# Altium project PCB_Project.PrjPcb
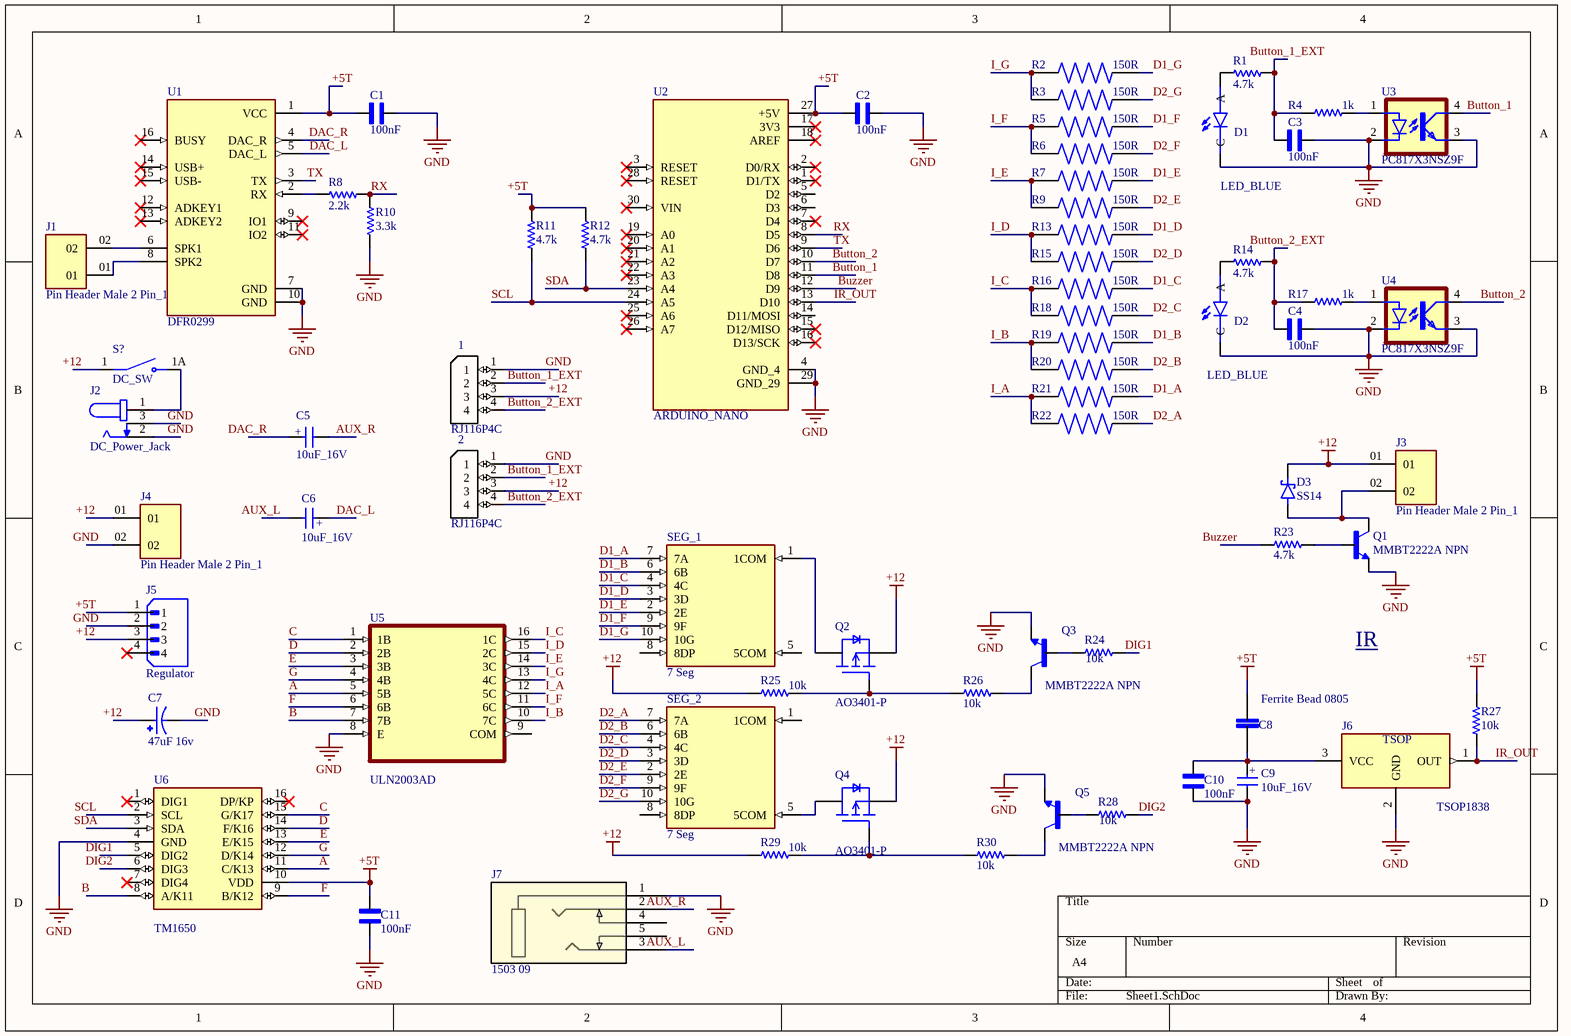
[diagram p0: Sheet1.SchDoc]
1 sheet, 67 parts. Net scope: global (net labels, ports and power ports of the same name join across sheets).
Board file: PCB1.PcbDoc

## Sheet Sheet1.SchDoc
size A4; SheetNumber: 1; SheetTotal: 1

### Parts
1  RJ116P4C  [*RJ6P4C]
2  RJ116P4C  [*RJ6P4C]
C1  100nF  [Capacitor 0805]
C2  100nF  [Capacitor 0805]
C3  100nF  [Capacitor 0805]
C4  100nF  [Capacitor 0805]
C5  10uF_16V  [10uF_16V]
C6  10uF_16V  [10uF_16V]
C7  47uF 16v  [47uf 16v]
C8  Ferrite Bead 0805  [Ferrite Bead 0805]
C9  10uF_16V  [10uF_16V]
C10  100nF  [Capacitor 0805]
C11  100nF  [Capacitor 0805]
D1  LED_BLUE  [LED_0603]
D2  LED_BLUE  [LED_0603]
D3  SS14  [SS14]
J1  Pin Header Male 2 Pin_1  [2Pin-M-Header_3MX1-254MM - duplicate]
J2  DC_Power_Jack  [DC_Power_Jack]
J3  Pin Header Male 2 Pin_1  [2Pin-M-Header_3MX1-254MM - duplicate]
J4  Pin Header Male 2 Pin_1  [2Pin-M-Header_3MX1-254MM - duplicate]
J5  Regulator  [Regulator]
J6  TSOP1838  [TSOP1838]
J7  1503 09  [3.5mm_AUX]
Q1  MMBT2222A NPN  [NPN_SOT23]
Q2  AO3401-P  [AO-3401-P-SOT23-3]
Q3  MMBT2222A NPN  [NPN_SOT23]
Q4  AO3401-P  [AO-3401-P-SOT23-3]
Q5  MMBT2222A NPN  [NPN_SOT23]
R1  4.7k  [RES0603]
R2  150R  [RESC3115X65N]
R3  150R  [RESC3115X65N]
R4  1k  [RES0603]
R5  150R  [RESC3115X65N]
R6  150R  [RESC3115X65N]
R7  150R  [RESC3115X65N]
R8  2.2k  [RES0603]
R9  150R  [RESC3115X65N]
R10  3.3k  [RES0603]
R11  4.7k  [RES0603]
R12  4.7k  [RES0603]
R13  150R  [RESC3115X65N]
R14  4.7k  [RES0603]
R15  150R  [RESC3115X65N]
R16  150R  [RESC3115X65N]
R17  1k  [RES0603]
R18  150R  [RESC3115X65N]
R19  150R  [RESC3115X65N]
R20  150R  [RESC3115X65N]
R21  150R  [RESC3115X65N]
R22  150R  [RESC3115X65N]
R23  4.7k  [RES0603]
R24  10k  [RES0603]
R25  10k  [RES0603]
R26  10k  [RES0603]
R27  10k  [RES0603]
R28  10k  [RES0603]
R29  10k  [RES0603]
R30  10k  [RES0603]
S?  DC_SW  [DC_SW]
SEG_1  7 Seg  [2.3_7-SEG_DIS]
SEG_2  7 Seg  [2.3_7-SEG_DIS]
U1  DFR0299  [MODULE_DFR0299]
U2  ARDUINO_NANO  [MODULE_ARDUINO_NANO_SMD]
U3  PC817X3NSZ9F  [PC 817]
U4  PC817X3NSZ9F  [PC 817]
U5  ULN2003AD  [SOIC127P600X175-16N]
U6  TM1650  [SOIC127P604X185-16N]

### Nets
+5T: C1.1 C2.1 C8.2 C11.2 J5.1 R11.2 R12.2 R27.2 U1.1(VCC) U2.27(+5V) U6.10(VDD)
+12: 1.3 2.3 C7.1 D3.C(K) J3.01 J4.01 J5.3 Q2.2(S) Q4.2(S) R25.1 R29.1 S?.1
GND: 1.1 2.1 C1.2 C2.2 C3.1 C4.2 C7.2 C9.2(NEG) C10.1 C11.1 D1.C D2.C J2.2 J2.3 J4.02 J5.2 J6.2(GND) J7.1 Q1.2(E) Q3.2(E) Q5.2(E) R10.2 U1.7(GND) U1.10(GND) U2.4(GND_4) U2.29(GND_29) U3.2(C) U3.3(EMIT) U4.2(C) U4.3(EMIT) U5.8(E) U6.4(GND)
A: U5.5(5B) U6.11(C/K13)
AUX_L: C6.2(NEG) J7.3
AUX_R: C5.2(NEG) J7.2
B: U5.7(7B) U6.8(A/K11)
Button_1: U2.11(D8) U3.4(COL)
Button_1_EXT: 1.2 2.2 C3.2 R1.1 R4.1
Button_2: U2.10(D7) U4.4(COL)
Button_2_EXT: 1.4 2.4 C4.1 R14.1 R17.1
Buzzer: R23.1 U2.12(D9)
C: U5.1(1B) U6.15(G/K17)
D: U5.2(2B) U6.14(F/K16)
D1_A: R21.2 SEG_1.7(7A)
D1_B: R19.2 SEG_1.6(6B)
D1_C: R16.2 SEG_1.4(4C)
D1_D: R13.2 SEG_1.3(3D)
D1_E: R7.2 SEG_1.2(2E)
D1_F: R5.2 SEG_1.9(9F)
D1_G: R2.2 SEG_1.10(10G)
D2_A: R22.2 SEG_2.7(7A)
D2_B: R20.2 SEG_2.6(6B)
D2_C: R18.2 SEG_2.4(4C)
D2_D: R15.2 SEG_2.3(3D)
D2_E: R9.2 SEG_2.2(2E)
D2_F: R6.2 SEG_2.9(9F)
D2_G: R3.2 SEG_2.10(10G)
DAC_L: C6.1(POS) U1.5(DAC_L)
DAC_R: C5.1(POS) U1.4(DAC_R)
DIG1: R24.2 U6.5(DIG2)
DIG2: R28.2 U6.6(DIG3)
E: U5.3(3B) U6.13(E/K15)
F: U5.6(6B) U6.9(B/K12)
G: U5.4(4B) U6.12(D/K14)
I_A: R21.1 R22.1 U5.12(5C)
I_B: R19.1 R20.1 U5.10(7C)
I_C: R16.1 R18.1 U5.16(1C)
I_D: R13.1 R15.1 U5.15(2C)
I_E: R7.1 R9.1 U5.14(3C)
I_F: R5.1 R6.1 U5.11(6C)
I_G: R2.1 R3.1 U5.13(4C)
IR_OUT: J6.1(OUT) R27.1 U2.13(D10)
RX: R8.1 R10.1 U2.8(D5)
SCL: R11.1 U2.24(A5) U6.2(SCL)
SDA: R12.1 U2.23(A4) U6.3(SDA)
TX: U1.3(TX) U2.9(D6)
NetC8_1: C8.1 C9.1(POS) C10.2 J6.3(VCC)
NetD1_A: D1.A R1.2
NetD2_A: D2.A R14.2
NetD3_A: D3.A J3.02 Q1.3(C)
NetJ1_01: J1.01 U1.8(SPK2)
NetJ1_02: J1.02 U1.6(SPK1)
NetJ2_1: J2.1 S?.1A
NetQ1_1: Q1.1(B) R23.2
NetQ2_1: Q2.1(G) R25.2 R26.1
NetQ2_3: Q2.3(D) SEG_1.1(1COM)
NetQ3_1: Q3.1(B) R24.1
NetQ3_3: Q3.3(C) R26.2
NetQ4_1: Q4.1(G) R29.2 R30.1
NetQ4_3: Q4.3(D) SEG_2.5(5COM)
NetQ5_1: Q5.1(B) R28.1
NetQ5_3: Q5.3(C) R30.2
NetR4_2: R4.2 U3.1(A)
NetR8_2: R8.2 U1.2(RX)
NetR17_2: R17.2 U4.1(A)

Not connected (* = marked no-connect by the designer): J5 4*; J7 4 5; SEG_1 5(5COM) 8(8DP); SEG_2 1(1COM) 8(8DP); U1 9(IO1)* 11(IO2)* 12(ADKEY1)* 13(ADKEY2)* 14(USB+)* 15(USB-)* 16(BUSY)*; U2 1(D1/TX)* 2(D0/RX)* 3(RESET)* 5(D2) 6(D3) 7(D4)* 14(D11/MOSI) 15(D12/MISO)* 16(D13/SCK)* 17(3V3)* 18(AREF)* 19(A0)* 20(A1)* 21(A2)* 22(A3)* 25(A6)* 26(A7)* 28(RESET)* 30(VIN)*; U5 9(COM); U6 1(DIG1)* 7(DIG4)* 16(DP/KP)*

### Notes on the sheet
- IR
- (in symbol 10uF_16V) +
- (in symbol TSOP1838) TSOP

### Library data of the parts
1 2 = RJ116P4C: MF: TE Connectivity / Raychem; MP: RJ11-6P4C; SnapEDA_Link: https://www.snapeda.com/parts/RJ11-6P4C/TE+Connectivity+%252F+Raychem/view-part/?ref=snap; Package: None; Check_prices: https://www.snapeda.com/parts/RJ11-6P4C/TE+Connectivity+%252F+Raychem/view-part/?ref=eda; Value: *
C1-C4 C10 C11 = Capacitor 0805: 0.1 ÂµF Â±10% 50V Ceramic Capacitor X7R 0805 (2012 Metric); MF: Murata; MP: GCE21BR71H104KA01L; SnapEDA_Link: https://www.snapeda.com/parts/GCE21BR71H104KA01L/Murata+Electronics+North+America/view-part/?ref=snap; Package: 2012 Murata; Value: *; Check_prices: https://www.snapeda.com/parts/GCE21BR71H104KA01L/Murata+Electronics+North+America/view-part/?ref=eda
C5 C6 C9 = 10uF_16V: CAP, 10UF, 16V, ALU ELEC, SMD; AE Capacitor Case:Radial Can - SMD; Capacitance:10ÂµF; Voltage Rating:16V; ESR:-; Product Range:WCAP-ASLU Series; Lifetime @ Temperature:2000 hours @ 85Â°C; Operating Temperature Min:-40Â°C; Operating Temperature Max:85Â°C;; MF: WÃ¼rth Elektronik; MP: 865090368008; SnapEDA_Link: https://www.snapeda.com/parts/865090368008/W%25C3%25BCrth+Elektronik+Midcom/view-part/?ref=snap; Package: None; Value: *; Check_prices: https://www.snapeda.com/parts/865090368008/W%25C3%25BCrth+Elektronik+Midcom/view-part/?ref=eda
C7 = 47uF 16v: 47ÂµF 16V Aluminum Electrolytic Capacitors Radial, Can - SMD 1000 Hrs @ 105Â°C; MF: Panasonic; MP: EEE-HA1C470P; SnapEDA_Link: https://www.snapeda.com/parts/EEE-HA1C470P/Panasonic/view-part/2303036/?ref=snap; Package: RADIAL-2 Panasonic; Purchase-URL: https://pricing.snapeda.com/search/part/EEE-HA1C470P/?ref=eda; Price: None; Value: *; Check_prices: https://www.snapeda.com/parts/EEE-HA1C470P/Panasonic/view-part/2303036/?ref=eda; Availability: In Stock
C8 = Ferrite Bead 0805: BLM Series 0805 1 kOhm 200 mA 0.45 DCR Surface Mount Ferrite Bead; MF: Murata; MP: BLM21AH102SN1D; SnapEDA_Link: https://www.snapeda.com/parts/BLM21AH102SN1D/Murata/view-part/?ref=snap; Package: 805-2 Murata; Value: *; Check_prices: https://www.snapeda.com/parts/BLM21AH102SN1D/Murata/view-part/?ref=eda
D1 D2 = LED_0603: SMD LED 0603 INGAN GREEN | Dialight 597-3326-607F; SnapEDA_Link: https://www.snapeda.com/parts/597-3326-607F/Dialight/view-part/?ref=snap; Package: 0603 Dialight; Value: *; MF: Dialight; MP: 597-3326-607F; Check_prices: https://www.snapeda.com/parts/597-3326-607F/Dialight/view-part/?ref=eda
D3 = SS14: 1A, 40V, Schottky Rectifier; MF: Taiwan Semiconductor; SnapEDA_Link: https://www.snapeda.com/parts/SS14/taiwan/view-part/?ref=snap; Package: SMA-2 Taiwan Semiconductor; Value: *; MP: SS14; Check_prices: https://www.snapeda.com/parts/SS14/taiwan/view-part/?ref=eda
J1 J3 J4 = Pin Header Male 2 Pin_1: MP: TSW-101-23-L-T; Package: None; Price: None; Value: *; Availability: Unavailable
J2 = DC_Power_Jack: Power Barrel Connector Jack 2.05mm ID (0.081), 5.50mm OD (0.217) Through Hole, Right Angle; MF: Global Connector Technology; MP: DCJ200-10-A-K1-K; SnapEDA_Link: https://www.snapeda.com/parts/DCJ200-10-A-K1-K/Global+Connector+Technology/view-part/?ref=snap; Package: None; Value: *; Check_prices: https://www.snapeda.com/parts/DCJ200-10-A-K1-K/Global+Connector+Technology/view-part/?ref=eda
J5 = Regulator: Connector Header Through Hole 4 position 0.098 (2.50mm); MF: JST Sales; MP: B4B-XH-A(LF)(SN); SnapEDA_Link: https://www.snapeda.com/parts/B4B-XH-A(LF)(SN)/JST+Sales+America+Inc./view-part/?ref=snap; Package: None; Value: *; Check_prices: https://www.snapeda.com/parts/B4B-XH-A(LF)(SN)/JST+Sales+America+Inc./view-part/?ref=eda
J6 = TSOP1838: IR Remote Receiver 38KHz 35m 3-Pin; MF: Vishay; SnapEDA_Link: https://www.snapeda.com/parts/TSOP1838/Vishay/view-part/?ref=snap; Package: None; Value: *; MP: TSOP1838; Check_prices: https://www.snapeda.com/parts/TSOP1838/Vishay/view-part/?ref=eda
J7 = 3.5mm_AUX: Description; Manufacturer_Name: Lumberg; Copyright: Copyright (C) 2025 Ultra Librarian. All rights reserved.; Manufacturer_Part_Number: 1503 09; RefDes: RefDes; Type: Type
Q1 Q3 Q5 = MMBT2222A NPN: Bipolar (BJT) Transistor NPN 40V 600mA 300MHz 310mW Surface Mount SOT-23-3; MF: STMicroelectronics; SnapEDA_Link: https://www.snapeda.com/parts/MMBT2222A/STMicroelectronics/view-part/?ref=snap; Package: SOT-23 Multicomp; Value: *; MP: MMBT2222A; Check_prices: https://www.snapeda.com/parts/MMBT2222A/STMicroelectronics/view-part/?ref=eda
Q2 Q4 = AO3401-P: P-Channel 30 V 4A (Ta) 1.4W (Ta) Surface Mount SOT-23-3; MF: Alpha & Omega Semiconductor; MP: AO3401; SnapEDA_Link: https://www.snapeda.com/parts/AO3401/Alpha/view-part/?ref=snap; Package: SOT-23-3 Alpha &amp; Omega Semiconductor; Value: *; Check_prices: https://www.snapeda.com/parts/AO3401/Alpha/view-part/?ref=eda
R1 R4 R8 R10-R12 R14 R17 R23-R30 = Resistor 0603: Fixed Resistor CRGCQ 1206 10K 5%; MF: TE Connectivity; MP: CRGCQ1206J10K; SnapEDA_Link: https://www.snapeda.com/parts/CRGCQ1206J10K/TE+Connectivity/view-part/?ref=snap; Package: 3115 TE Connectivity; Value: *; Check_prices: https://www.snapeda.com/parts/CRGCQ1206J10K/TE+Connectivity/view-part/?ref=eda
R2 R3 R5-R7 R9 R13 R15 R16 R18-R22 = CRGCQ1206J10K: Fixed Resistor CRGCQ 1206 10K 5%; MF: TE Connectivity; SnapEDA_Link: https://www.snapeda.com/parts/CRGCQ1206J10K/TE+Connectivity/view-part/?ref=snap; Package: 3115 TE Connectivity; Value: *; MP: CRGCQ1206J10K; Check_prices: https://www.snapeda.com/parts/CRGCQ1206J10K/TE+Connectivity/view-part/?ref=eda
S? = DC_SW: Rocker Switch,R1966 Series,SPST,ON-OFF,Concave,Black,I/O, 15A, 125VAC,R/A P | E-Switch R1966ABLKBLKFR; SnapEDA_Link: https://www.snapeda.com/parts/R1966ABLKBLKFR/E-Switch/view-part/?ref=snap; Package: None; Value: *; MF: E-Switch; MP: R1966ABLKBLKFR; Check_prices: https://www.snapeda.com/parts/R1966ABLKBLKFR/E-Switch/view-part/?ref=eda
U1 = DFR0299: - MP3 Player Audio Arduino Platform Evaluation Expansion Board; MF: DFRobot; SnapEDA_Link: https://www.snapeda.com/parts/DFR0299/DFRobot/view-part/?ref=snap; Package: None; Value: *; MP: DFR0299; Check_prices: https://www.snapeda.com/parts/DFR0299/DFRobot/view-part/?ref=eda
U2 = ARDUINO_NANO: Small, complete, and breadboard-friendly board based on the ATmega328 (Arduino Nano 3.x); SnapEDA_Link: https://www.snapeda.com/parts/Arduino%20Nano/Arduino/view-part/?ref=snap; Package: Non-Standard Arduino; Value: *; MF: Arduino; MP: Arduino Nano; Check_prices: https://www.snapeda.com/parts/Arduino%20Nano/Arduino/view-part/?ref=eda
U3 U4 = PC817X3NSZ9F: Optoisolator Transistor Output 5000Vrms 1 Channel 4-DIP; MF: Sharp Microelectronics; SnapEDA_Link: https://www.snapeda.com/parts/PC817X3NSZ9F/Sharp+Microelectronics/view-part/?ref=snap; Package: DIP-4 Sharp Microelectronics; Value: *; MP: PC817X3NSZ9F; Check_prices: https://www.snapeda.com/parts/PC817X3NSZ9F/Sharp+Microelectronics/view-part/?ref=eda
U5 = ULN2003AD: 50-V, 7-ch darlington transistor array, -20C to 70C; MF: Texas Instruments; SnapEDA_Link: https://www.snapeda.com/parts/ULN2003AD/Texas+Instruments/view-part/?ref=snap; Package: SOIC-16 Texas Instruments; Value: *; MP: ULN2003AD; Check_prices: https://www.snapeda.com/parts/ULN2003AD/Texas+Instruments/view-part/?ref=eda
U6 = TM1650: <b>The TM1650 is a dedicated LED (LED display) drive control circuit with a keyboard scan interface. The MCU input and output control digital interface, data latch, LED driver, keyboard scan, brightness adjustment and other circuits are integrated inside. The TM1650's stable performance, reliable quality, and high immunity to interference make it suitable for long-term continuous operation in 24 hours</b><p> Source: <a href="http://www.titanmec.com/index.php/en/product/download/id/540.html"> Datasheet </a>; MF: tm; Package: None; Price: None; Value: *; SnapEDA_Link: https://www.snapeda.com/parts/TM1650/TMMH/view-part/?ref=snap; MP: TM1650; Availability: Not in stock; Check_prices: https://www.snapeda.com/parts/TM1650/TMMH/view-part/?ref=eda